# EAGLE schematic smart hub v2 (EAGLE 9.6.2)
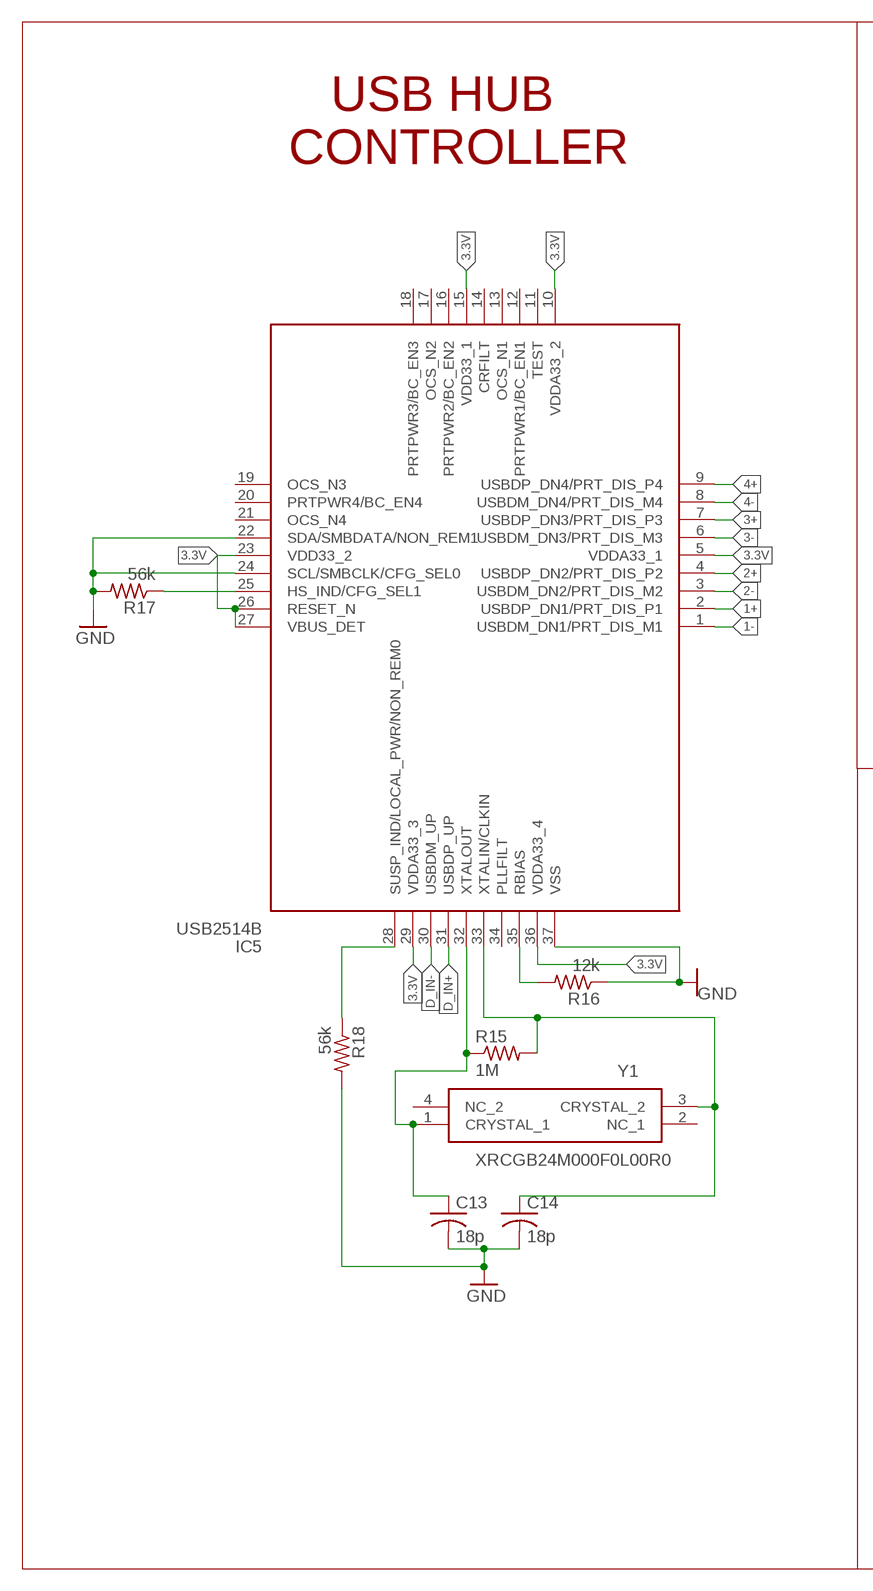
[diagram p0: schematic, sheet 1, part 1 of 2]
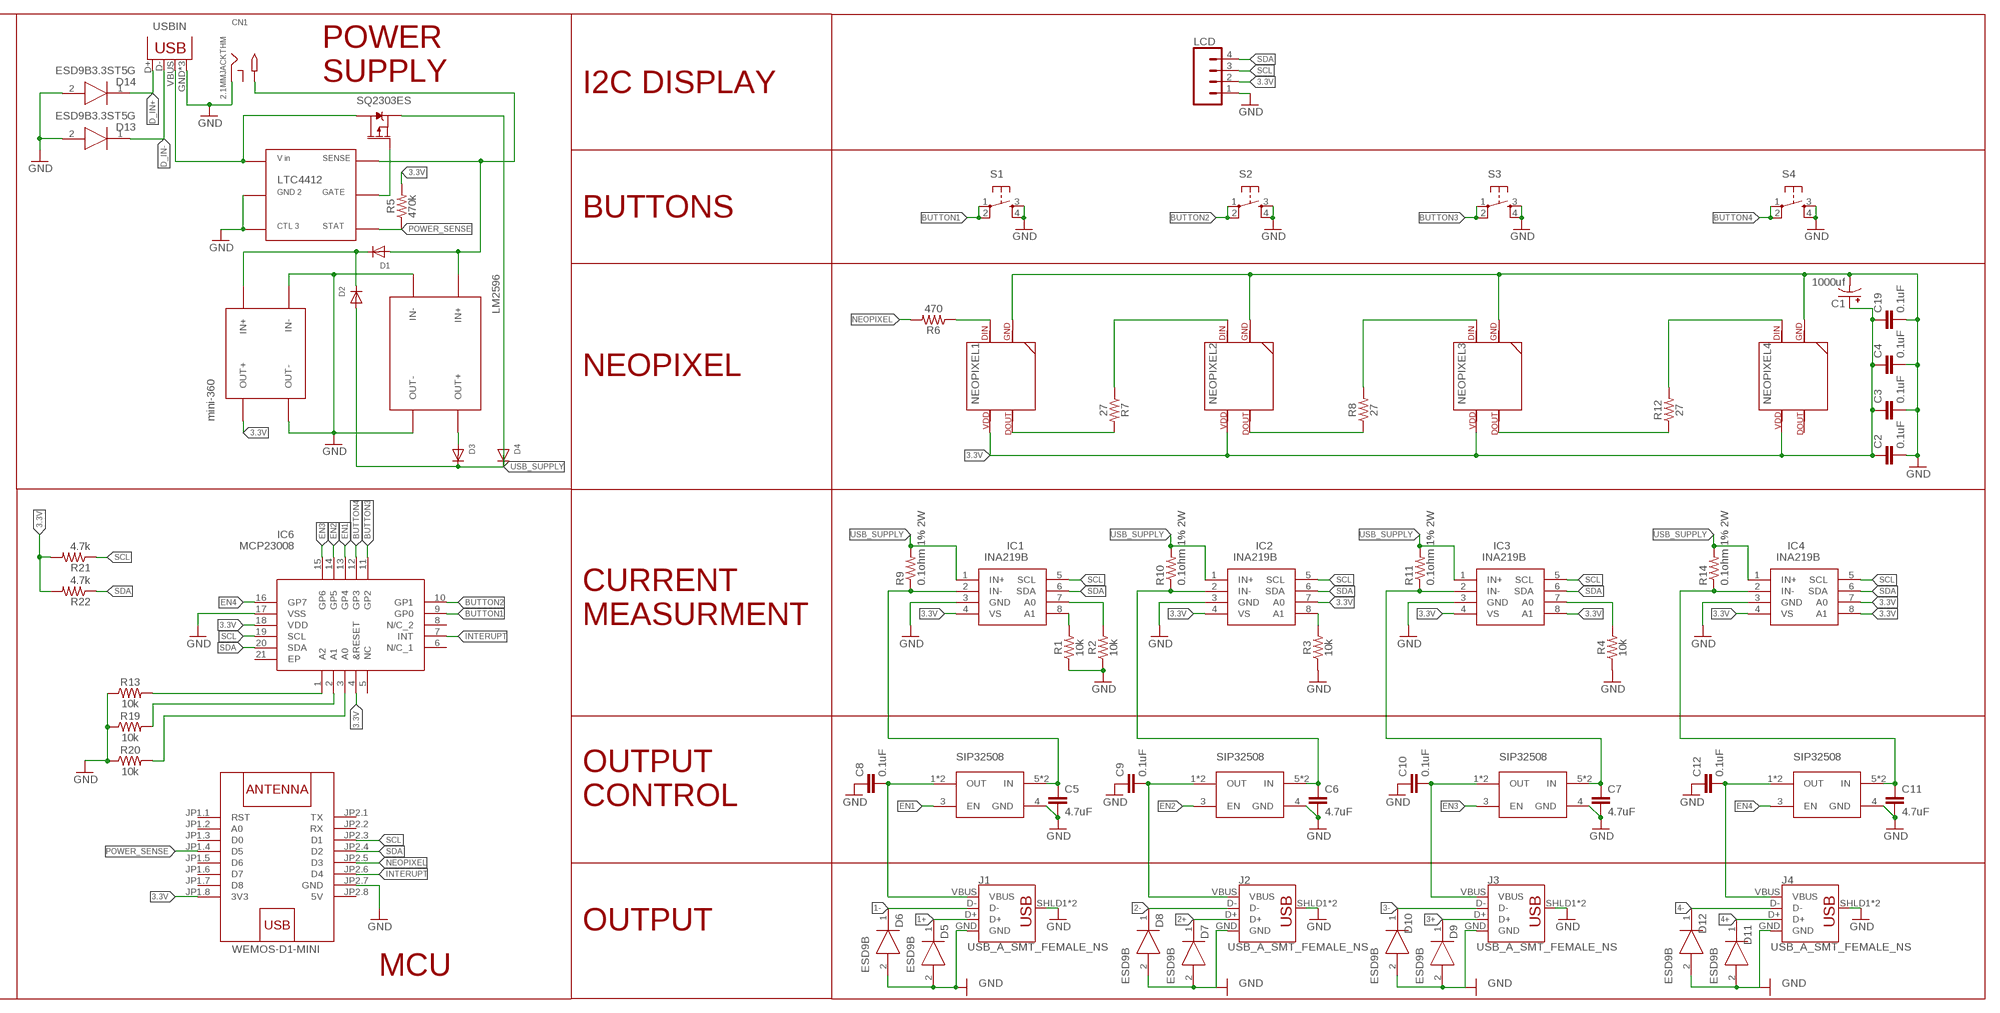
[diagram p1: schematic, sheet 1, part 2 of 2]

## Parts
C1  1000uf  1000UF-RADIAL-5MM-35V-20%-KIT  [CPOL-RADIAL-5MM-10MM-KIT]
C2  0.1uF  0.1UF-0603-25V-5%  [0603]
C3  0.1uF  0.1UF-0603-25V-5%  [0603]
C4  0.1uF  0.1UF-0603-25V-5%  [0603]
C5  4.7uF  4.7UF-0603-6.3V-(10%)  [0603]
C6  4.7uF  4.7UF-0603-6.3V-(10%)  [0603]
C7  4.7uF  4.7UF-0603-6.3V-(10%)  [0603]
C8  0.1uF  0.1UF-0603-25V-(+80/-20%)  [0603]
C9  0.1uF  0.1UF-0603-25V-(+80/-20%)  [0603]
C10  0.1uF  0.1UF-0603-25V-(+80/-20%)  [0603]
C11  4.7uF  4.7UF-0603-6.3V-(10%)  [0603]
C12  0.1uF  0.1UF-0603-25V-(+80/-20%)  [0603]
C13  18p  C-USC0603  [C0603]
C14  18p  C-USC0603  [C0603]
C19  0.1uF  0.1UF-0603-25V-5%  [0603]
CN1  2.1MMJACKTHM  [PJ-102A]
D1  DIODE_SOD-123FL  [SOD-123FL]
D2  DIODE_SOD-123FL  [SOD-123FL]
D3  DIODE_SOD-123FL  [SOD-123FL]
D4  DIODE_SOD-123FL  [SOD-123FL]
D5  ESD9B  ESD9B3.3ST5G  [SODFL1006X40N]
D6  ESD9B  ESD9B3.3ST5G  [SODFL1006X40N]
D7  ESD9B  ESD9B3.3ST5G  [SODFL1006X40N]
D8  ESD9B  ESD9B3.3ST5G  [SODFL1006X40N]
D9  ESD9B  ESD9B3.3ST5G  [SODFL1006X40N]
D10  ESD9B  ESD9B3.3ST5G  [SODFL1006X40N]
D11  ESD9B  ESD9B3.3ST5G  [SODFL1006X40N]
D12  ESD9B  ESD9B3.3ST5G  [SODFL1006X40N]
D13  ESD9B3.3ST5G  [SODFL1006X40N]
D14  ESD9B3.3ST5G  [SODFL1006X40N]
IC1  INA219B  INA219BIDCNT  [SOT65P280X145-8N]
IC2  INA219B  INA219BIDCNT  [SOT65P280X145-8N]
IC3  INA219B  INA219BIDCNT  [SOT65P280X145-8N]
IC4  INA219B  INA219BIDCNT  [SOT65P280X145-8N]
IC5  USB2514B  USB2514B-AEZC  [QFN50P600X600X100-37N]
IC6  MCP23008  MCP23008-E_ML  [QFN50P400X400X100-21N]
J1  USB_A_SMT_FEMALE_NS  [USB-A-S-NOSILK-FEMALE]
J2  USB_A_SMT_FEMALE_NS  [USB-A-S-NOSILK-FEMALE]
J3  USB_A_SMT_FEMALE_NS  [USB-A-S-NOSILK-FEMALE]
J4  USB_A_SMT_FEMALE_NS  [USB-A-S-NOSILK-FEMALE]
LCD  CONN_04  [1X04]
LTC4412  LTC4412  [TSOT23-6]
NEOPIXEL1  SK6812NEOPIXEL5050  [SK6812]
NEOPIXEL2  SK6812NEOPIXEL5050  [SK6812]
NEOPIXEL3  SK6812NEOPIXEL5050  [SK6812]
NEOPIXEL4  SK6812NEOPIXEL5050  [SK6812]
R1  10k  10KOHM-0603-1/10W-1%  [0603]
R2  10k  10KOHM-0603-1/10W-1%  [0603]
R3  10k  10KOHM-0603-1/10W-1%  [0603]
R4  10k  10KOHM-0603-1/10W-1%  [0603]
R5  470k  43KOHM-0603-1/10W-1%  [0603]
R6  470  470OHM-0603-1/10W-1%  [0603]
R7  27  470OHM-0603-1/10W-1%  [0603]
R8  27  470OHM-0603-1/10W-1%  [0603]
R9  0.1ohm 1% 2W  R-US_R2512W  [R2512W]
R10  0.1ohm 1% 2W  R-US_R2512W  [R2512W]
R11  0.1ohm 1% 2W  R-US_R2512W  [R2512W]
R12  27  470OHM-0603-1/10W-1%  [0603]
R13  10k  10KOHM-0603-1/10W-1%  [0603]
R14  0.1ohm 1% 2W  R-US_R2512W  [R2512W]
R15  1M  R-US_R0603  [R0603]
R16  12k  R-US_R0603  [R0603]
R17  56k  R-US_R0603  [R0603]
R18  56k  R-US_R0603  [R0603]
R19  10k  10KOHM-0603-1/10W-1%  [0603]
R20  10k  10KOHM-0603-1/10W-1%  [0603]
R21  4.7k  R-US_R0603  [R0603]
R22  4.7k  R-US_R0603  [R0603]
S1  TAC_SWITCHPTH  [TACTILE-PTH]
S2  TAC_SWITCHPTH  [TACTILE-PTH]
S3  TAC_SWITCHPTH  [TACTILE-PTH]
S4  TAC_SWITCHPTH  [TACTILE-PTH]
U$1  WEMOS-D1-MINI  [WEMOS-D1-MINI]
U$2  SQ2303ES  [SOT23]
U$3  SIP32508  [SOT23-6]
U$4  SIP32508  [SOT23-6]
U$5  SIP32508  [SOT23-6]
U$6  LM2596  DC-DC-STEP-DOWN-LM2596  [DC-DC-STEP-DOWN-LM2596]
U$7  mini-360  DC-DC-STEP-DOWN-MP2307  [DC-DC-STEP-DOWN-MP2307]
U$8  SIP32508  [SOT23-6]
USBIN  USB-MICROB  [USB-MICROB]
Y1  XRCGB24M000F0L00R0  [XRCGB24]

## Nets
1+: D5.1(K) IC5.2(USBDP_DN1/PRT_DIS_P1) J1.D+
1-: D6.1(K) IC5.1(USBDM_DN1/PRT_DIS_M1) J1.D-
2+: D7.1(K) IC5.4(USBDP_DN2/PRT_DIS_P2) J2.D+
2-: D8.1(K) IC5.3(USBDM_DN2/PRT_DIS_M2) J2.D-
3+: D9.1(K) IC5.7(USBDP_DN3/PRT_DIS_P3) J3.D+
3-: D10.1(K) IC5.6(USBDM_DN3/PRT_DIS_M3) J3.D-
3.3V: C1.+ C2.1 C3.1 C4.1 C19.1 IC1.4(VS) IC2.4(VS) IC2.7(A0) IC3.4(VS) IC3.8(A1) IC4.4(VS) IC4.7(A0) IC4.8(A1) IC5.5(VDDA33_1) IC5.10(VDDA33_2) IC5.15(VDD33_1) IC5.23(VDD33_2) IC5.26(RESET_N) IC5.27(VBUS_DET) IC5.29(VDDA33_3) IC5.36(VDDA33_4) IC6.4(&RESET) IC6.18(VDD) LCD.2 NEOPIXEL1.1(VDD) NEOPIXEL2.1(VDD) NEOPIXEL3.1(VDD) NEOPIXEL4.1(VDD) R5.2 R21.2 R22.2 U$1.JP1.8(3V3) U$7.OUT+
4+: D11.1(K) IC5.9(USBDP_DN4/PRT_DIS_P4) J4.D+
4-: D12.1(K) IC5.8(USBDM_DN4/PRT_DIS_M4) J4.D-
BUTTON1: IC6.9(GP0) S1.1 S1.2
BUTTON2: IC6.10(GP1) S2.1 S2.2
BUTTON3: IC6.11(GP2) S3.1 S3.2
BUTTON4: IC6.12(GP3) S4.1 S4.2
D_IN+: D14.1(K) IC5.31(USBDP_UP) USBIN.D+
D_IN-: D13.1(K) IC5.30(USBDM_UP) USBIN.D-
EN1: IC6.13(GP4) U$3.3(EN)
EN2: IC6.14(GP5) U$4.3(EN)
EN3: IC6.15(GP6) U$5.3(EN)
EN4: IC6.16(GP7) U$8.3(EN)
GND: C1.- C2.2 C3.2 C4.2 C5.2 C6.2 C7.2 C8.1 C9.1 C10.1 C11.2 C12.1 C13.2 C14.2 C19.2 CN1.RING D5.2(A) D6.2(A) D13.2(A) D14.2(A) IC1.3(GND) IC2.3(GND) IC3.3(GND) IC4.3(GND) IC5.22(SDA/SMBDATA/NON_REM1) IC5.24(SCL/SMBCLK/CFG_SEL0) IC5.37(VSS) IC6.17(VSS) J1.GND J1.SHLD1(SHIELD) J1.SHLD2(SHIELD) J2.SHLD1(SHIELD) J2.SHLD2(SHIELD) J3.SHLD1(SHIELD) J3.SHLD2(SHIELD) J4.SHLD1(SHIELD) J4.SHLD2(SHIELD) LCD.1 LTC4412.2 LTC4412.3 NEOPIXEL1.3(GND) NEOPIXEL2.3(GND) NEOPIXEL3.3(GND) NEOPIXEL4.3(GND) R1.1 R2.1 R3.1 R4.1 R13.1 R16.1 R17.2 R18.2 R19.1 R20.1 S1.3 S1.4 S2.3 S2.4 S3.3 S3.4 S4.3 S4.4 U$1.JP2.7(GND) U$3.4(GND) U$4.4(GND) U$5.4(GND) U$6.IN- U$6.OUT- U$7.IN- U$7.OUT- U$8.4(GND) USBIN.GND USBIN.MT1(GND) USBIN.MT2(GND)
GND1: D7.2(A) D8.2(A) J2.GND ; supply symbol labelled GND
GND2: D9.2(A) D10.2(A) J3.GND ; supply symbol labelled GND
GND3: D11.2(A) D12.2(A) J4.GND ; supply symbol labelled GND
INTERUPT: IC6.7(INT) U$1.JP2.6(D4)
N$1: CN1.TIP D1.A LTC4412.6 U$6.IN+
N$2: D1.C D2.C U$7.IN+
N$3: D4.A U$2.2(S)
N$4: D3.A U$6.OUT+
N$5: LTC4412.5 U$2.1(G)
N$6: NEOPIXEL2.4(DIN) R7.1
N$7: LTC4412.1 U$2.3(D) USBIN.VBUS
N$8: NEOPIXEL3.4(DIN) R8.2
N$9: NEOPIXEL1.2(DOUT) R7.2
N$10: NEOPIXEL2.2(DOUT) R8.1
N$11: C5.1 IC1.2(IN-) R9.1 U$3.5(IN) U$3.6(IN)
N$12: C6.1 IC2.2(IN-) R10.1 U$4.5(IN) U$4.6(IN)
N$13: IC3.7(A0) R4.2
N$14: IC2.8(A1) R3.2
N$15: IC1.8(A1) R1.2
N$16: IC1.7(A0) R2.2
N$17: NEOPIXEL1.4(DIN) R6.1
N$18: NEOPIXEL4.4(DIN) R12.2
N$19: C7.1 IC3.2(IN-) R11.1 U$5.5(IN) U$5.6(IN)
N$20: NEOPIXEL3.2(DOUT) R12.1
N$21: C10.2 J3.VBUS U$5.1(OUT) U$5.2(OUT)
N$22: C9.2 J2.VBUS U$4.1(OUT) U$4.2(OUT)
N$23: IC6.1(A2) R13.2
N$24: IC6.2(A1) R19.2
N$25: C11.1 IC4.2(IN-) R14.1 U$8.5(IN) U$8.6(IN)
N$26: C12.2 J4.VBUS U$8.1(OUT) U$8.2(OUT)
N$35: C13.1 IC5.32(XTALOUT) R15.1 Y1.1(CRYSTAL_1)
N$36: C14.1 IC5.33(XTALIN/CLKIN) R15.2 Y1.3(CRYSTAL_2)
N$37: IC5.25(HS_IND/CFG_SEL1) R17.1
N$38: IC5.28(SUSP_IND/LOCAL_PWR/NON_REM0) R18.1
N$39: IC5.35(RBIAS) R16.2
N$40: IC6.3(A0) R20.2
N$41: C8.2 J1.VBUS U$3.1(OUT) U$3.2(OUT)
NEOPIXEL: R6.2 U$1.JP2.5(D3)
POWER_SENSE: LTC4412.4 R5.1 U$1.JP1.4(D5)
SCL: IC1.5(SCL) IC2.5(SCL) IC3.5(SCL) IC4.5(SCL) IC6.19(SCL) LCD.3 R21.1 U$1.JP2.3(D1)
SDA: IC1.6(SDA) IC2.6(SDA) IC3.6(SDA) IC4.6(SDA) IC6.20(SDA) LCD.4 R22.1 U$1.JP2.4(D2)
USB_SUPPLY: D2.A D3.C D4.C IC1.1(IN+) IC2.1(IN+) IC3.1(IN+) IC4.1(IN+) R9.2 R10.2 R11.2 R14.2
Unconnected: CN1.RING_SW IC5.11(TEST) IC5.12(PRTPWR1/BC_EN1) IC5.13(OCS_N1) IC5.14(CRFILT) IC5.16(PRTPWR2/BC_EN2) IC5.17(OCS_N2) IC5.18(PRTPWR3/BC_EN3) IC5.19(OCS_N3) IC5.20(PRTPWR4/BC_EN4) IC5.21(OCS_N4) IC5.34(PLLFILT) IC6.5(NC) IC6.6(N/C_1) IC6.8(N/C_2) IC6.21(EP) NEOPIXEL4.2(DOUT) U$1.JP1.1(RST) U$1.JP1.2(A0) U$1.JP1.3(D0) U$1.JP1.5(D6) U$1.JP1.6(D7) U$1.JP1.7(D8) U$1.JP2.1(TX) U$1.JP2.2(RX) Y1.2(NC_1) Y1.4(NC_2)

## Notes on the sheet
- POWER
  SUPPLY
- I2C DISPLAY
- USB HUB
  CONTROLLER
- LTC4412
- BUTTONS
- NEOPIXEL
- CURRENT
  MEASURMENT
- OUTPUT
  CONTROL
- OUTPUT
- MCU

## Power pins joined to a net without a drawn wire
5V: U$1.JP2.8(5V)

## Library data of the parts
C1 = SparkFun-Capacitors:1000UF: 1,000µF/1mF ceramic capacitors A capacitor is a passive two-terminal electrical component used to store electrical energy temporarily in an electric field. CAP-08070; PROD_ID: CAP-09538; VALUE: 1mf
C2-C4 C19 = SparkFun-Capacitors:0.1UF: 0.1µF ceramic capacitors A capacitor is a passive two-terminal electrical component used to store electrical energy temporarily in an electric field.; PROD_ID: CAP-08604
C5-C7 C11 = SparkFun-Capacitors:4.7UF: 4.7µF ceramic capacitors A capacitor is a passive two-terminal electrical component used to store electrical energy temporarily in an electric field.; PROD_ID: CAP-08280
C8-C10 C12 = SparkFun-Capacitors:0.1UF: 0.1µF ceramic capacitors A capacitor is a passive two-terminal electrical component used to store electrical energy temporarily in an electric field.; PROD_ID: CAP-00810
C13 C14 = adafruit:C-US: CAPACITOR, American symbol
CN1 = adafruit:2.1MMJACK: 2.1mm x 5.5mm THM DC jack with internal switch. Digikey part #PJ-102A, 4UCON part #05537 2.1mm x 5.5mm SMT DC jack with internal switch. Digikey part #PJ-002A-SMT, 4UCON part #03267 By microbuilder.eu & adafruit.com
D1-D4 = adafruit:DIODE: Diode SMADIODE - SMA Surface Mount Package 20V 1A Schottky Diode Digikey: 641-1014-6-ND DO-1N4148 - Through Hole Small Current Diode SOD-123 20V 1 A (.5mV Vf) Schottky Diode - Digikey: MBRX120TPMSCT-ND SOD-323 10V 570mA (.38mV Vf, 3ns) Schottky Diode - Digikey: ZLLS410CT-ND SOD-523 30V 30mA Schottky Diode (RB751S-40TE61) - Digikey: RB751S-40TE61CT-ND SOT23-R/W - SOT23 Package (R = Solder Paste/Reflow Ovens, W = Hand-Soldering) BAT54Film 40V 300mA - Digikey: 497-7162-1-ND
D5-D14 = SamacSys_Parts:ESD9B3.3ST5G: TVS ESD Suppressor 18KV SOD-923 ON Semiconductor ESD9B3.3ST5G Bi-Directional TVS Diode, 300mW peak, 2-Pin SOD-923 Source: Datasheet <http://www.onsemi.com/pub/Collateral/ESD9B-D.PDF>; ARROW_PART_NUMBER: ESD9B3.3ST5G; ARROW_PRICE-STOCK: https://www.arrow.com/en/products/esd9b3.3st5g/on-semiconductor; DESCRIPTION: TVS ESD Suppressor 18KV SOD-923 ON Semiconductor ESD9B3.3ST5G Bi-Directional TVS Diode, 300mW peak, 2-Pin SOD-923; HEIGHT: 0.4mm; MANUFACTURER_NAME: ON Semiconductor; MANUFACTURER_PART_NUMBER: ESD9B3.3ST5G; MOUSER_PART_NUMBER: 863-ESD9B3.3ST5G; MOUSER_PRICE-STOCK: https://www.mouser.co.uk/ProductDetail/ON-Semiconductor/ESD9B33ST5G?qs=yU2N9dt%252BrfmXrPf3vhgUEA%3D%3D
IC1-IC4 = INA219BIDCNT:INA219BIDCNT: INA219BIDCNT, Intelligent Power Switch High Side Current Shunt, Power Monitor, 0.01A, 5.5V, 8-Pin, SOT-23 Source: Datasheet <http://www.ti.com/lit/ds/symlink/ina219.pdf>; ARROW_PART_NUMBER: INA219BIDCNT; ARROW_PRICE-STOCK: https://www.arrow.com/en/products/ina219bidcnt/texas-instruments; DESCRIPTION: INA219BIDCNT, Intelligent Power Switch High Side Current Shunt, Power Monitor, 0.01A, 5.5V, 8-Pin, SOT-23; HEIGHT: 1.45mm; MANUFACTURER_NAME: Texas Instruments; MANUFACTURER_PART_NUMBER: INA219BIDCNT; MOUSER_PART_NUMBER: 595-INA219BIDCNT; MOUSER_PRICE-STOCK: https://www.mouser.co.uk/ProductDetail/Texas-Instruments/INA219BIDCNT?qs=1WmUhT%2FVMIMmEKxVjzYikA%3D%3D
IC5 = SamacSys_Parts:USB2514B-AEZC: USB 2.0 Hub Controller 4-Port BC QFN36 Microchip USB2514B-AEZC, USB Controller, 480MBps, USB 2.0, 3.3 V, 36-Pin QFN Source: Datasheet <http://ww1.microchip.com/downloads/en/DeviceDoc/00001692C.pdf>; ARROW_PART_NUMBER: USB2514B-AEZC; ARROW_PRICE-STOCK: https://www.arrow.com/en/products/usb2514b-aezc/microchip-technology; DESCRIPTION: USB 2.0 Hub Controller 4-Port BC QFN36 Microchip USB2514B-AEZC, USB Controller, 480MBps, USB 2.0, 3.3 V, 36-Pin QFN; HEIGHT: 1mm; MANUFACTURER_NAME: Microchip; MANUFACTURER_PART_NUMBER: USB2514B-AEZC; MOUSER_PART_NUMBER: 886-USB2514B-AEZC; MOUSER_PRICE-STOCK: https://www.mouser.co.uk/ProductDetail/Microchip-Technology/USB2514B-AEZC?qs=pA5MXup5wxGEnK1%2F4ENYlA%3D%3D
IC6 = SamacSys_Parts:MCP23008-E_ML: 8-Bit I/O Port Expander I2C 1.7M QFN20EP Microchip MCP23008-E/ML, 8-channel 8bit I/O Expander 1.7MHz, I2C, 20-Pin QFN Source: Datasheet <http://uk.rs-online.com/web/p/products/7709704>; ARROW_PART_NUMBER: MCP23008-E/ML; ARROW_PRICE-STOCK: https://www.arrow.com/en/products/mcp23008-eml/microchip-technology; DESCRIPTION: 8-Bit I/O Port Expander I2C 1.7M QFN20EP Microchip MCP23008-E/ML, 8-channel 8bit I/O Expander 1.7MHz, I2C, 20-Pin QFN; HEIGHT: 1mm; MANUFACTURER_NAME: Microchip; MANUFACTURER_PART_NUMBER: MCP23008-E/ML; MOUSER_PART_NUMBER: 579-MCP23008-E/ML; MOUSER_PRICE-STOCK: https://www.mouser.co.uk/ProductDetail/Microchip-Technology/MCP23008-E-ML?qs=usxtMOJb1Rw9YcrGR8Z%252BbQ%3D%3D
J1-J4 = SparkFun-Connectors:USB_A: USB-A Connector Male and female variants, as well as PTH and SMT variants SparkFun Products: SparkFun XBee Explorer Dongle <https://www.sparkfun.com/products/11697> PTH Male SparkFun MicroView-USB Programmer <https://www.sparkfun.com/products/12924> SMT Male SparkFun USB Type A Female Breakout <https://www.sparkfun.com/products/12700> SMT Female; PROD_ID: CONN-09520; SF_ID: PRT-09011
LCD = SparkFun-Connectors:CONN_04: Multi connection point. Often used as Generic Header-pin footprint for 0.1 inch spaced/style header connections On any of the 0.1 inch spaced packages, you can populate with these: Break Away Headers - Straight <https://www.sparkfun.com/products/116> (PRT-00116) Break Away Male Headers - Right Angle <https://www.sparkfun.com/products/553> (PRT-00553) Female Headers <https://www.sparkfun.com/products/115> (PRT-00115) Break Away Headers - Machine Pin <https://www.sparkfun.com/products/117> (PRT-00117) Break Away Female Headers - Swiss Machine Pin <https://www.sparkfun.com/products/743> (PRT-00743) For SCREWTERMINALS and SPRING TERMINALS visit here: Screw Terimnals on SparkFun.com <https://www.sparkfun.com/search/results?term=Screw+Terminals> (5mm/3.5mm/2.54mm spacing) This device is also useful as a general connection point to wire up your design to another part of your project. Our various solder wires solder well into these plated through hole pads. Hook-Up Wire - Assortment (Stranded, 22 AWG) <https://www.sparkfun.com/products/11375> (PRT-11375) Hook-Up Wire - Assortment (Solid Core, 22 AWG) <https://www.sparkfun.com/products/11367> (PRT-11367) View the entire wire category on our website here <https://www.sparkfun.com/categories/141> Special notes: Molex polarized connector foot print use with SKU : PRT-08231 with associated crimp pins and housings. 1MM SMD Version SKU: PRT-10208; PROD_ID: CONN-09696
LTC4412 = custom parts:LTC4412: power switch over
NEOPIXEL1-NEOPIXEL4 = custom parts:SK6812: for 5050 sk6812 LED
R1-R4 R13 R19 R20 = SparkFun-Resistors:10KOHM: 10kΩ resistor A resistor is a passive two-terminal electrical component that implements electrical resistance as a circuit element. Resistors act to reduce current flow, and, at the same time, act to lower voltage levels within circuits. - Wikipedia; PROD_ID: RES-00824
R5 = SparkFun-Resistors:43KOHM: 43kΩ resistor A resistor is a passive two-terminal electrical component that implements electrical resistance as a circuit element. Resistors act to reduce current flow, and, at the same time, act to lower voltage levels within circuits. - Wikipedia; PROD_ID: RES-07858; VALUE: 43k
R6 = SparkFun-Resistors:470OHM: 470Ω resistor A resistor is a passive two-terminal electrical component that implements electrical resistance as a circuit element. Resistors act to reduce current flow, and, at the same time, act to lower voltage levels within circuits. - Wikipedia; PROD_ID: RES-07869
R7 R8 R12 = SparkFun-Resistors:470OHM: 470Ω resistor A resistor is a passive two-terminal electrical component that implements electrical resistance as a circuit element. Resistors act to reduce current flow, and, at the same time, act to lower voltage levels within circuits. - Wikipedia; PROD_ID: RES-07869; VALUE: 470
R9-R11 R14 R21 R22 = adafruit:R-US_: RESISTOR, American symbol
R15 = resistor:R-US_: RESISTOR, American symbol
R16-R18 = rcl:R-US_: RESISTOR, American symbol; SPICEPREFIX: R
S1-S4 = SparkFun-Retired:TAC_SWITCH: Momentary Switch Button commonly used for reset or general input. Spark Fun Electronics SKU : COM-00097 SMT- SWCH-08247
U$1 = diy-modules:WEMOS-D1-MINI: WEMOS D1 mini: Mini Wi-Fi Board based on ESP-8266 device More details can be found here: https://www.wemos.cc/product/d1-mini.html Click here to find device on ebay.com <http://www.ebay.com/sch/wemos+d1+mini+nodemcu>
U$2 = custom parts:SQ2303ES: P-Channel Mosfet
U$3-U$5 U$8 = custom parts:SIP32508: SiP32508 high side driver, 5v 3A
U$6 = diy-modules:DC-DC-STEP-DOWN-LM2596: DC/DC Step-Down Regulator based on LM2596-ADJ chip LM2596 datasheet available here: http://www.ti.com/lit/ds/symlink/lm2596.pdf Click here to find device on ebay.com <http://www.ebay.com/sch/lm2596+power+regulator>
U$7 = diy-modules:DC-DC-STEP-DOWN-MP2307: DC/DC Step-Down Regulator based on MP2307DN chip MP2307 datasheet available here: https://cdn-shop.adafruit.com/datasheets/MP2307_r1.9.pdf Click here to find device on ebay.com <http://www.ebay.com/sch/dc+dc+3a+mini+converter>
USBIN = SparkFun-Retired:USB: USB Connectors USB-B-PTH is fully proven SKU : PRT-00139/CONN-08278 USB-miniB is fully proven SKU : PRT-00587 USB-A-PCB is untested. USB-A-H is throughly reviewed, but untested. Spark Fun Electronics SKU : PRT-00437 USB-B-SMT is throughly reviewed, but untested. Needs silkscreen touching up. USB-A-S has not been used/tested USB-MB-H has not been used/tested USB-MICROB has been used. CONN-09505; PROD_ID: CONN-09505
Y1 = SamacSys_Parts:XRCGB24M000F0L00R0: Murata 24MHz Crystal +/-100ppm SMD 4-Pin 2 x 1.6 x 0.7mm Source: Datasheet <https://www.murata.com/en-eu/products/productdata/8801075331102/SPEC-XRCGB24M000F0L00R0.pdf?1541043009000>; ARROW_PART_NUMBER: XRCGB24M000F0L00R0; ARROW_PRICE-STOCK: https://www.arrow.com/en/products/xrcgb24m000f0l00r0/murata-manufacturing; DESCRIPTION: Murata 24MHz Crystal +/-100ppm SMD 4-Pin 2 x 1.6 x 0.7mm; HEIGHT: mm; MANUFACTURER_NAME: Murata Electronics; MANUFACTURER_PART_NUMBER: XRCGB24M000F0L00R0; MOUSER_PART_NUMBER: 81-XRCGB24M000F0L0R0; MOUSER_PRICE-STOCK: https://www.mouser.com/Search/Refine.aspx?Keyword=81-XRCGB24M000F0L0R0